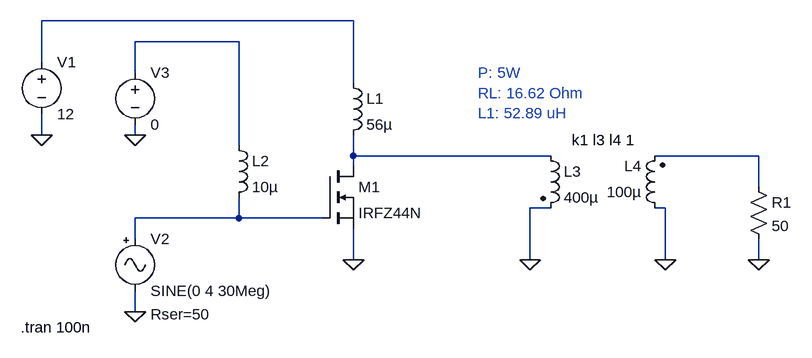
[diagram p0: schematic 5W QRP Amplifier.asc]
5W QRP Amplifier.asc, the LTspice schematic file:
Version 4
SHEET 1 1112 680
WIRE 432 -16 -48 -16
WIRE 256 16 96 16
WIRE -48 48 -48 -16
WIRE 96 64 96 16
WIRE 432 80 432 -16
WIRE -48 160 -48 128
WIRE 96 160 96 144
WIRE 256 176 256 16
WIRE 432 192 432 160
WIRE 736 192 432 192
WIRE 1056 192 896 192
WIRE 432 208 432 192
WIRE 1056 240 1056 192
WIRE 736 272 704 272
WIRE 912 272 896 272
WIRE 256 288 256 256
WIRE 256 288 96 288
WIRE 384 288 256 288
WIRE 96 320 96 288
WIRE 432 352 432 304
WIRE 704 352 704 272
WIRE 912 352 912 272
WIRE 1056 352 1056 320
WIRE 96 432 96 400
FLAG -48 160 0
FLAG 96 432 0
FLAG 432 352 0
FLAG 704 352 0
FLAG 96 160 0
FLAG 1056 352 0
FLAG 912 352 0
SYMBOL voltage -48 32 R0
WINDOW 123 0 0 Left 0
WINDOW 39 0 0 Left 0
SYMATTR InstName V1
SYMATTR Value 12
SYMBOL nmos 384 208 R0
SYMATTR InstName M1
SYMATTR Value IRFZ44N
SYMBOL Misc\\signal 96 304 R0
WINDOW 123 0 0 Left 0
WINDOW 39 24 132 Left 2
SYMATTR SpiceLine Rser=50
SYMATTR InstName V2
SYMATTR Value SINE(0 4 30Meg)
SYMBOL ind 416 64 R0
SYMATTR InstName L1
SYMATTR Value 56µ
SYMBOL ind 240 160 R0
SYMATTR InstName L2
SYMATTR Value 10µ
SYMBOL voltage 96 48 R0
WINDOW 123 0 0 Left 0
WINDOW 39 0 0 Left 0
SYMATTR InstName V3
SYMATTR Value 0
SYMBOL res 1040 224 R0
SYMATTR InstName R1
SYMATTR Value 50
SYMBOL ind2 720 176 R0
SYMATTR InstName L3
SYMATTR Value 400µ
SYMATTR Type ind
SYMBOL ind2 912 288 R180
WINDOW 0 36 80 Left 2
WINDOW 3 36 40 Left 2
SYMATTR InstName L4
SYMATTR Value 100µ
SYMATTR Type ind
TEXT 624 64 Left 2 ;P: 5W\nRL: 16.62 Ohm\nL1: 52.89 uH
TEXT -80 456 Left 2 !.tran 100n
TEXT 768 168 Left 2 !k1 l3 l4 1

The netlist it stands for:
* 5W QRP Amplifier.asc
V1 N001 0 12
M1 N003 N005 0 0 IRFZ44N
V2 N005 0 SINE(0 4 30Meg) Rser=50
L1 N001 N003 56µ
L2 N002 N005 10µ
V3 N002 0 0
R1 N004 0 50
L3 N003 0 400µ
L4 0 N004 100µ
.model NMOS NMOS
.model PMOS PMOS
.lib standard.mos
* P: 5W
* RL: 16.62 Ohm
* L1: 52.89 uH
.tran 100n
k1 l3 l4 1
.backanno
.end